# EAGLE design H23R30 (EAGLE 9.6.2)

## Sheet 1 of 2
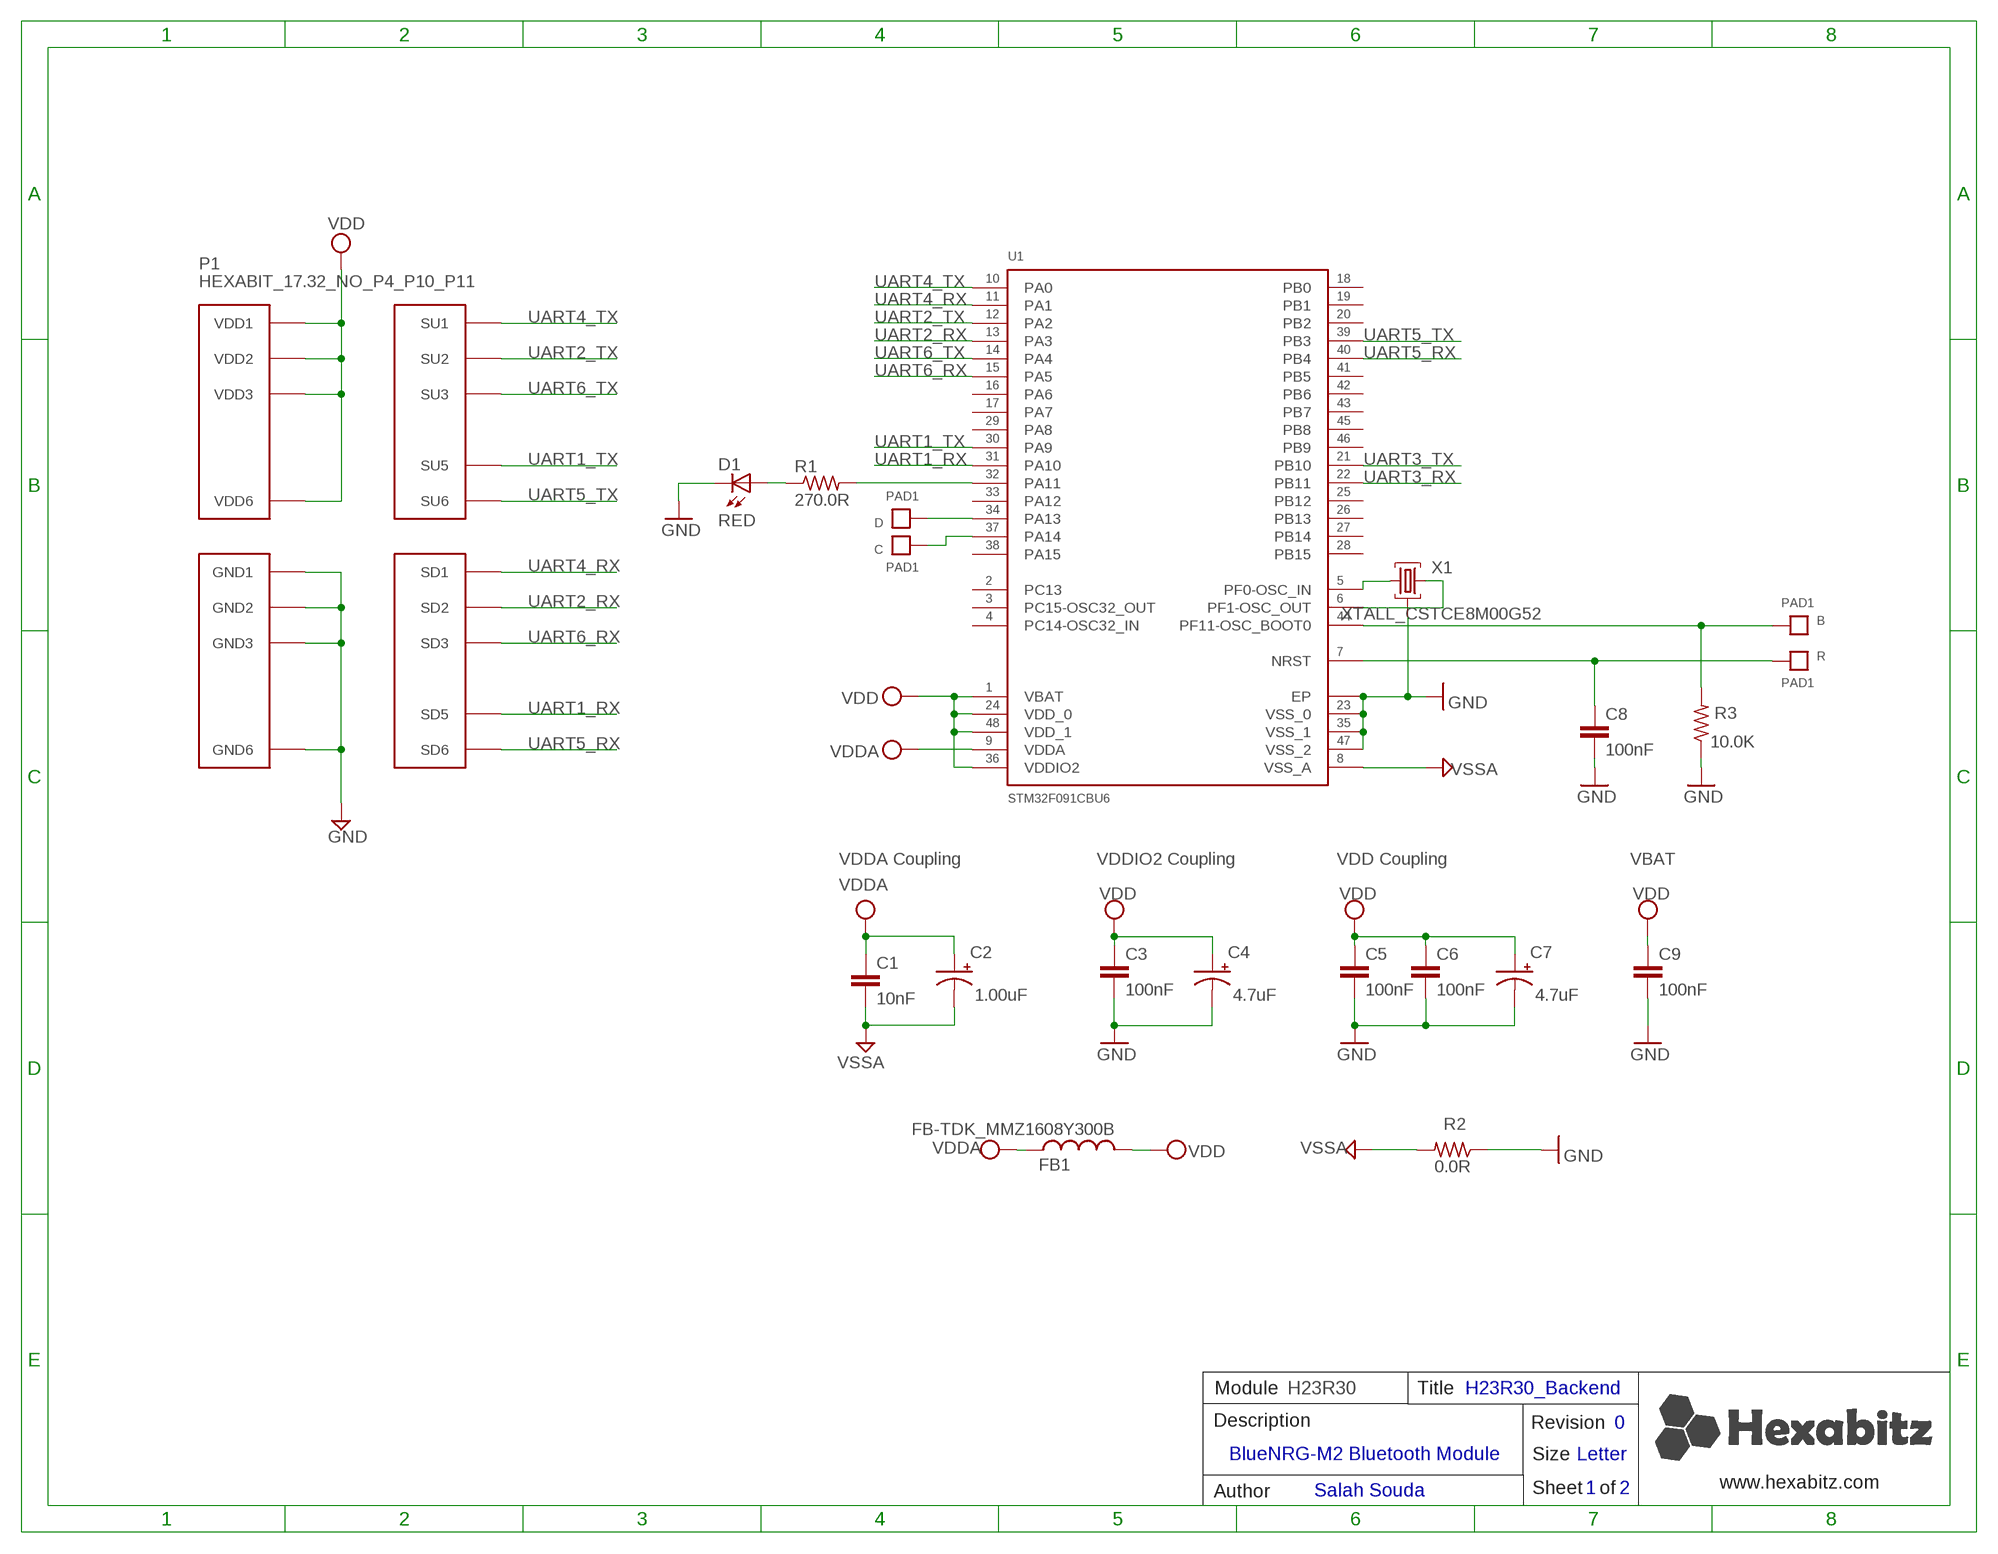
[diagram p0: schematic, sheet 1]

### Parts
B  PAD1  [PAD1]
C  PAD1  [PAD1]
C1  10nF  C-0603  [C-0603]
C2  1.00uF  C-0805-POL  [C-0805-POL]
C3  100nF  C-0603  [C-0603]
C4  4.7uF  C-0805-POL  [C-0805-POL]
C5  100nF  C-0603  [C-0603]
C6  100nF  C-0603  [C-0603]
C7  4.7uF  C-0805-POL  [C-0805-POL]
C8  100nF  C-0603  [C-0603]
C9  100nF  C-0603  [C-0603]
D  PAD1  [PAD1]
D1  RED  VLMS1300-GS08  [VLMS1300-GS08]
FB1  FB-TDK_MMZ1608Y300B  [FB-TDK_MMZ1608Y300B]
P1  HEXABIT_17.32_NO_P4_P10_P11  [HEXABIT_17.32_NO_P4_P10_P11]
R  PAD1  [PAD1]
R1  270.0R  R-0603  [R-0603]
R2  0.0R  R-0603  [R-0603]
R3  10.0K  R-0603  [R-0603]
U1  STM32F091CBU6  [STM32F091CBU6]
X1  XTALL_CSTCE8M00G52  [XTALL_CSTCE8M00G52]

### Nets
B1: B.P$1 B.P$2 R3.2 U1.P$44(PF11-OSC_BOOT0)
GND: C3.2 C4.2(-) C5.2 C6.2 C7.2(-) C8.2 C9.2 D1.C P1.PAD_PD7(GND1) P1.PAD_PD8(GND2) P1.PAD_PD9(GND3) P1.PAD_PD12(GND6) R2.1 R3.1 U1.EP U1.P$23(VSS_0) U1.P$35(VSS_1) U1.P$47(VSS_2) X1.P$2 ; also sheet 2
N$3: R1.2 U1.P$32(PA11)
N$4: D1.A R1.1
N$5: U1.P$5(PF0-OSC_IN) X1.P$1
N$6: U1.P$6(PF1-OSC_OUT) X1.P$3
N$7: D.P$1 D.P$2 U1.P$34(PA13)
N$9: C.P$1 C.P$2 U1.P$37(PA14)
R1: C8.1 R.P$1 R.P$2 U1.P$7(NRST)
UART1_RX: P1.PAD_PD5(SD5) U1.P$31(PA10)
UART1_TX: P1.PAD_PU5(SU5) U1.P$30(PA9)
UART2_RX: P1.PAD_PD2(SD2) U1.P$13(PA3)
UART2_TX: P1.PAD_PU2(SU2) U1.P$12(PA2)
UART3_RX: U1.P$22(PB11) ; also sheet 2
UART3_TX: U1.P$21(PB10) ; also sheet 2
UART4_RX: P1.PAD_PD1(SD1) U1.P$11(PA1)
UART4_TX: P1.PAD_PU1(SU1) U1.P$10(PA0)
UART5_RX: P1.PAD_PD6(SD6) U1.P$40(PB4)
UART5_TX: P1.PAD_PU6(SU6) U1.P$39(PB3)
UART6_RX: P1.PAD_PD3(SD3) U1.P$15(PA5)
UART6_TX: P1.PAD_PU3(SU3) U1.P$14(PA4)
VDD: C3.1 C4.1(+) C5.1 C6.1 C7.1(+) C9.1 FB1.2 P1.PAD_PU7(VDD1) P1.PAD_PU8(VDD2) P1.PAD_PU9(VDD3) P1.PAD_PU12(VDD6) U1.P$1(VBAT) U1.P$24(VDD_0) U1.P$36(VDDIO2) U1.P$48(VDD_1) ; also sheet 2
VDDA: C1.1 C2.1(+) FB1.1 U1.P$9(VDDA)
VSSA: C1.2 C2.2(-) R2.2 U1.P$8(VSS_A)
Unconnected: U1.P$2(PC13) U1.P$3(PC14-OSC32_IN) U1.P$4(PC15-OSC32_OUT) U1.P$16(PA6) U1.P$17(PA7) U1.P$18(PB0) U1.P$19(PB1) U1.P$20(PB2) U1.P$25(PB12) U1.P$26(PB13) U1.P$27(PB14) U1.P$28(PB15) U1.P$29(PA8) U1.P$33(PA12) U1.P$38(PA15) U1.P$41(PB5) U1.P$42(PB6) U1.P$43(PB7) U1.P$45(PB8) U1.P$46(PB9)

### Notes on the sheet
- VDDA Coupling | VDDIO2 Coupling | VDD Coupling | VBAT
- Module | H23R30 | Title | H23R30_Backend
- Description | Revision | 0
- BlueNRG-M2 Bluetooth Module
- Size | Letter
- www.hexabitz.com
- Author | Salah Souda | Sheet   of | 1 | 2
- C:/Users/Admin/Desktop/logodraft.bmp

## Sheet 2 of 2
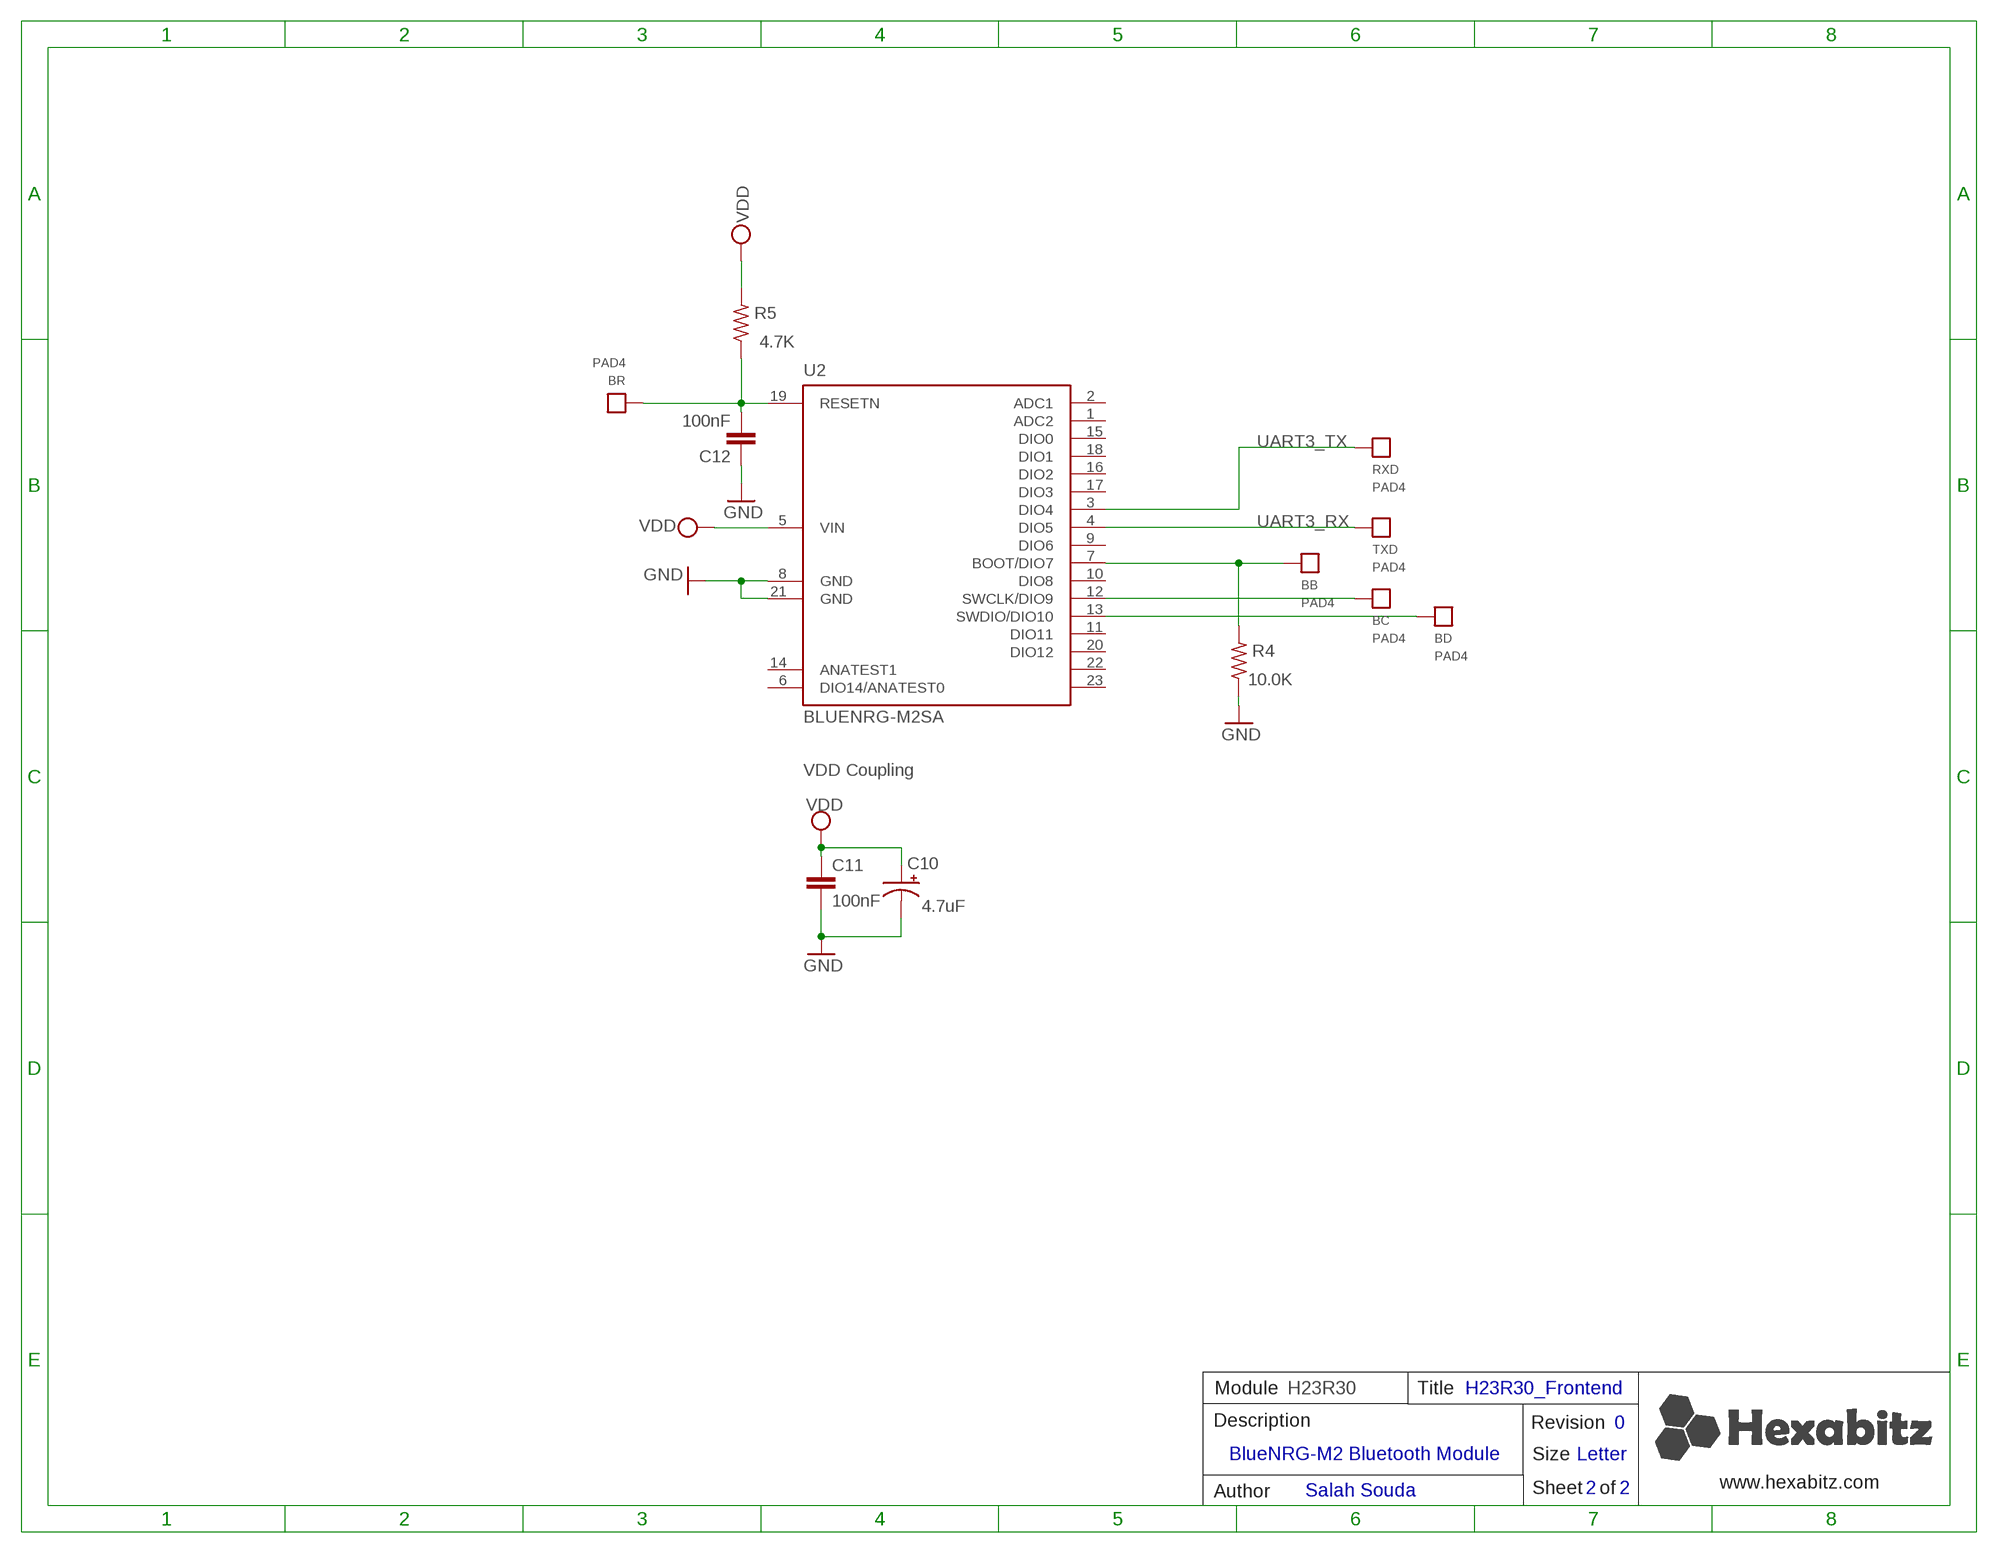
[diagram p1: schematic, sheet 2]

### Parts
BB  PAD4  [PAD4]
BC  PAD4  [PAD4]
BD  PAD4  [PAD4]
BR  PAD4  [PAD4]
C10  4.7uF  C-0805-POL  [C-0805-POL]
C11  100nF  C-0603  [C-0603]
C12  100nF  C-0603  [C-0603]
R4  10.0K  R-0603  [R-0603]
R5  4.7K  R-0603  [R-0603]
RXD  PAD4  [PAD4]
TXD  PAD4  [PAD4]
U2  BLUENRG-M2SA  [BLURNGR-M2SA_FOOTPRINT]

### Nets
B2: BB.P$1 R4.2 U2.7(BOOT/DIO7)
GND: C10.2(-) C11.2 C12.1 R4.1 U2.8(GND) U2.21(GND) ; also sheet 1
N$1: BD.P$1 U2.13(SWDIO/DIO10)
N$2: BC.P$1 U2.12(SWCLK/DIO9)
N$8: BR.P$1 C12.2 R5.1 U2.19(RESETN)
UART3_RX: TXD.P$1 U2.4(DIO5) ; also sheet 1
UART3_TX: RXD.P$1 U2.3(DIO4) ; also sheet 1
VDD: C10.1(+) C11.1 R5.2 U2.5(VIN) ; also sheet 1
Unconnected: U2.1(ADC2) U2.2(ADC1) U2.6(DIO14/ANATEST0) U2.9(DIO6) U2.10(DIO8) U2.11(DIO11) U2.14(ANATEST1) U2.15(DIO0) U2.16(DIO2) U2.17(DIO3) U2.18(DIO1) U2.20(DIO12) U2.22 U2.23

### Notes on the sheet
- VDD Coupling
- Module | H23R30 | Title | H23R30_Frontend
- Description | Revision | 0
- BlueNRG-M2 Bluetooth Module
- Size | Letter
- www.hexabitz.com
- Author | Salah Souda | Sheet   of | 2 | 2

## Library data of the parts
B C D R = HEXABITZ_CONNECTION_PARTS:PAD1
BB BC BD BR RXD TXD = HEXABITZ_CONNECTION_PARTS:PAD4
C1 = HEXABITZ_RCLS:C-0603: CAP CER 10% X7R 0603; CAPACITANCE: 10nF; MFN: KEMET; MPN: C0603C103K5RACTU; OCTOPART_URL: https://octopart.com/c0603c103k5ractu-kemet-133094?r=sp&s=R_iPBxLnSmGqhkU2rIMFpg; TOLERANCE: 10%; VOLTAGE_RATING: 50V
C2 = HEXABITZ_RCLS:C-0805-POL: Cap Tant Solid SMD 2012; CAPACITANCE: 1.00uF; MFN: Yageo; MPN: CC0805KKX7R7BB105; OCTOPART_URL: https://octopart.com/cc0805kkx7r7bb105-yageo-8376555?r=sp&s=YKl1wwtkROau_X5nniH2ig; TOLERANCE: 10%; VOLTAGE_RATING: 16V
C3 C6 C8 = HEXABITZ_RCLS:C-0603: CAP CER 10% X7R 0603; CAPACITANCE: 100nF; MFN: KEMET; MPN: C0603C104K8RACTU; OCTOPART_URL: https://octopart.com/c0603c104k8ractu-kemet-145075?r=sp&s=9bS9ASSwSEqMCE9KBEQZ0g; TOLERANCE: 10%; VOLTAGE_RATING: 10V
C4 C7 C10 = HEXABITZ_RCLS:C-0805-POL: Cap Tant Solid SMD 2012; CAPACITANCE: 4.7uF; MFN: Murata; MPN: GRM21BC81E475KA12L; OCTOPART_URL: https://octopart.com/grm21bc81e475ka12l-murata-10331911?r=sp&s=RY3qZSD8T6mG6TC9CHI5qQ; TOLERANCE: 10%; VOLTAGE_RATING: 25V
C5 C11 C12 = HEXABITZ_RCLS:C-0603: CAP CER 10% X7R 0603; CAPACITANCE: 100nF; MFN: KEMET; MPN: C0603C104K8RACTU; OCTOPART_URL: https://octopart.com/c0603c104k8ractu-kemet-145075?r=sp&s=9bS9ASSwSEqMCE9KBEQZ0g; TOLERANCE: 10%; VOLTAGE_RATING: 10
C9 = HEXABITZ_RCLS:C-0603: CAP CER 10% X7R 0603; CAPACITANCE: 100nF; MFN: KEMET; MPN: C0603C104K8RACTU; OCTOPART_URL: https://octopart.com/c0603c104k8ractu-kemet-145075?r=sp&s=9bS9ASSwSEqMCE9KBEQZ0g; TOLERANCE: 10V; VOLTAGE_RATING: 10%
D1 = HEXABITZ_USER_INTERFACE_PARTS:VLMS1300-GS08: Red 0603 130° Clear 54 mcd 2 V Surface Mount ChipLED ; Octopart Url : http://octopart.com/vlms1300-gs08-vishay-21709201; MFN: Vishay; MPN: VLMS1300-GS08; OCTOPART_URL: https://octopart.com/vlms1300-gs08-vishay-21709201?r=sp&s=_gcP4_q8T1SC6PJQPTQ9yA
FB1 = HEXABITZ_RCLS:FB-TDK_MMZ1608Y300B: Ferrite Beads Multi-Layer 30Ohm 25% 100MHz 1.5A 50mOhm DCR 0603; MFN: TDK; MPN: MMZ1608Y300B; OCTOPART_URL: https://octopart.com/mmz1608y300b-tdk-368280?r=sp&s=cd9_2ZEqQ9q9UNBuQgHAiA
P1 = hexabitz_connectors:HEXABIT_?_NO_P4_P10_P11: Hexabitz Hexagon Module Connector Hexagon side length = 17.32mm. The following ports are removed: P4 P10 P11
R1 = HEXABITZ_RCLS:R-0603: Thick Film Resistors - SMD 0603; MFN: Yageo; MPN: RC0603FR-07270RL; OCTOPART_URL: https://octopart.com/search?q=RC0603FR-07270RL&start=0; RESISTANCE: 270.0 Ohm; TOLERANCE: 1%
R2 = HEXABITZ_RCLS:R-0603: Thick Film Resistors - SMD 0603; MFN: Yageo; MPN: RC0603JR-070RL; OCTOPART_URL: https://octopart.com/rc0603jr-070rl-yageo-1241539?r=sp&s=X2NteqRjRNWrnx42Y0aliA; RESISTANCE: 0.0 Ohm
R3 R4 = HEXABITZ_RCLS:R-0603: Thick Film Resistors - SMD 0603; MFN: Yageo; MPN: RC0603JR-0710KL; OCTOPART_URL: https://octopart.com/search?q=RC0603JR-0710KL&start=0; RESISTANCE: 10.0K Ohm; TOLERANCE: 5%
R5 = HEXABITZ_RCLS:R-0603: Thick Film Resistors - SMD 0603; MFN: Yageo; MPN: RC0603JR-074K7L; OCTOPART_URL: https://octopart.com/rc0603jr-074k7l-yageo-55458509?r=sp; RESISTANCE: 4.7K Ohm; TOLERANCE: 5%
U1 = HEXABITZ_ICs:STM32F091CBU6: Description : ARM-based 32-bit MCU, CAN, 12 timers, ADC, DAC & Comm. Interface, 2 to 3.6 V, -40 to 85 degC, 48-Pin UFQFPN, RoHS, Tray ;Parameter : Ciiva URL : https://ciiva.com/part/STM32F091CBU6-20240708, CiivaID : 20240708, Clock Speed : 48000000.0 Hz, Lifecycle Status : Active, Mounting Style : Surface Mount, Number of Pins : 48, Octopart Url : https://octopart.com/stm32f091cbu6-stmicroelectronics-51988677, OctopartID : 5f4f955c32ec8088, RAM Memory Size : 32768 B, REACH SVHC Compliance : No SVHC, RoHS : Compliant,; MFN: STMicroelectronics; MPN: STM32F091CBU6; OCTOPART_URL: https://octopart.com/stm32f091cbu6-stmicroelectronics-51988677?r=sp&s=bU6fpgsrTZOxHyt7jkfh3w
U2 = HEXABITZ_ICs:BLUENRG-M2SA: Embedded ST BlueNRG-2 BLE SoC ultra-low power Cortex-M0 32-bit based core – Bluetooth v5.0 compliant – Programmable embedded 256 kB Flash – 24 kB embedded RAM with data retention – Operating supply voltage: from 1.7 to 3.6 V – 1 x UART, 1 x I2C, 1xSPI, 14 x GPIO, 2 x multifunction timer, 10-bit ADC, watchdog and RTC, DMA controller, PDM stream processor, SWD debug interface Source: Datasheet <https://www.st.com/content/st_com/en/products/wireless-transceivers-mcus-and-modules/bluetooth-bluetooth-low-energy/bluenrg-m2.html>; MFN: STMicroelectronics; MPN: BlueNRG_M2SA; OCTOPART_URL: https://octopart.com/bluenrg-m2sa-stmicroelectronics-104772812?r=sp
X1 = HEXABITZ_OTHER_PARTS:XTALL_CSTCE8M00G52: MURATA CSTCE8M00G52-R0 RESONATOR, SMD, 8MHZ ; Octopart Url : https://octopart.com/cstce8m00g52-r0-murata-7145559; MFN: Murata; MPN: CSTCE8M00G52Z-R0; OCTOPART_URL: https://octopart.com/cstce8m00g52z-r0-murata-17755941?r=sp&s=JDnNJnrHQhyS8Zk4ofFWXw

## Board
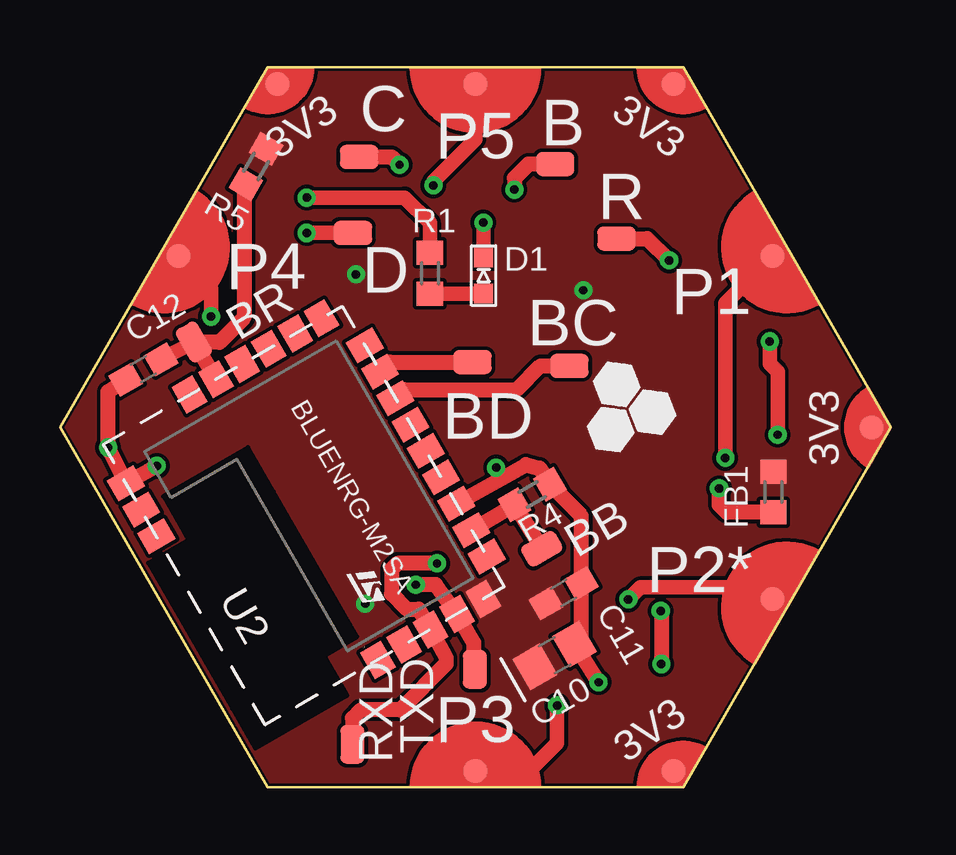
[diagram p2: board, top side]
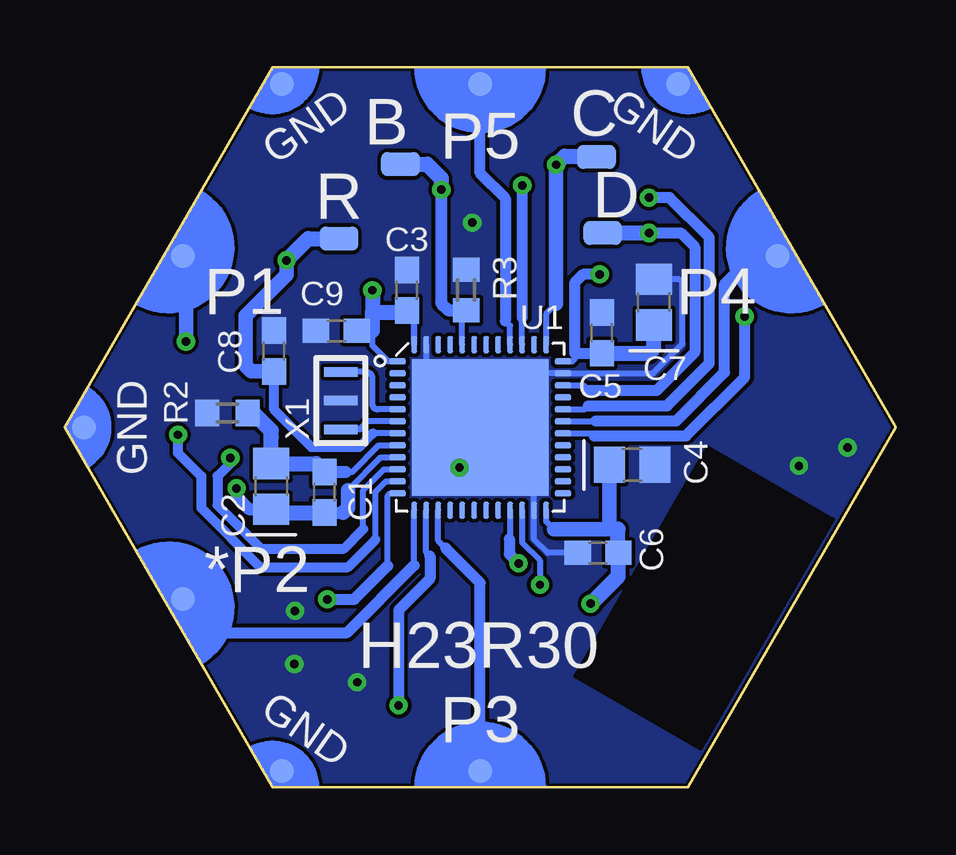
[diagram p3: board, bottom side, seen from below]

Size 34.64 x 30 mm. Coordinates in mm from the lower left corner, seen from the top.
Copper layers (1*16): Top 0.035mm / dielectric 1.5mm / Bottom 0.035mm
Design rules "2_layer": minimum track width 7mil, minimum drill 10mil, track to track 6mil, track to pad 6mil, pad to pad 6mil, via to via 6mil, smd to smd 0mil, copper to edge 1mil, drill to drill 8mil, minimum pad ring 10mil, minimum via ring 8mil, stop-mask expansion 2mil, vias tented up to drill 15mil, thermal gap 10mil

### Footprints (pad centres in the part's own frame; a part is rotated, then mirrored left to right if it is on the bottom)
PAD1 = smd 1.6 x 1: P$1 0,0 | smd 1.6 x 1 bottom: P$2 0,0
PAD4 = smd 1.6 x 1: P$1 0,0
C-0603 = smd 1.1 x 1: 1 -0.85,0; 2 0.85,0
C-0805-POL = smd 1.3 x 1.5: 1 -0.95,0; 2 0.95,0
VLMS1300-GS08 = smd 0.8 x 0.8: A 0,0.75; C 0,-0.75
FB-TDK_MMZ1608Y300B = smd 1 x 1.1: 1 -0.85,0; 2 0.85,0
HEXABIT_17.32_NO_P4_P10_P11 = smd 1 x 1 bottom: PAD_PD1 12.39,7.15; PAD_PD2 12.39,-7.15; PAD_PD3 0,-14.31; PAD_PD5 -12.39,7.15; PAD_PD6 0,14.31; PAD_PD7 8.26,14.31; PAD_PD8 16.52,0; PAD_PD9 8.26,-14.31; PAD_PD12 -8.26,14.31 | smd 1 x 1: PAD_PU1 12.39,7.15; PAD_PU2 12.39,-7.15; PAD_PU3 0,-14.31; PAD_PU5 -12.39,7.15; PAD_PU6 0,14.31; PAD_PU7 8.26,14.31; PAD_PU8 16.52,0; PAD_PU9 8.26,-14.31; PAD_PU12 -8.26,14.31
R-0603 = smd 1 x 1.1: 1 -0.85,0; 2 0.85,0
STM32F091CBU6 = smd 5.7 x 5.7: EP 0,0 | smd 0.25 x 0.7: P$1 -2.75,-3.45; P$2 -2.25,-3.45; P$3 -1.75,-3.45; P$4 -1.25,-3.45; P$5 -0.75,-3.45; P$6 -0.25,-3.45; P$7 0.25,-3.45; P$8 0.75,-3.45; P$9 1.25,-3.45; P$10 1.75,-3.45; P$11 2.25,-3.45; P$12 2.75,-3.45; P$25 2.75,3.45; P$26 2.25,3.45; P$27 1.75,3.45; P$28 1.25,3.45; P$29 0.75,3.45; P$30 0.25,3.45; P$31 -0.25,3.45; P$32 -0.75,3.45; P$33 -1.25,3.45; P$34 -1.75,3.45; P$35 -2.25,3.45; P$36 -2.75,3.45 | smd 0.7 x 0.25: P$13 3.45,-2.75; P$14 3.45,-2.25; P$15 3.45,-1.75; P$16 3.45,-1.25; P$17 3.45,-0.75; P$18 3.45,-0.25; P$19 3.45,0.25; P$20 3.45,0.75; P$21 3.45,1.25; P$22 3.45,1.75; P$23 3.45,2.25; P$24 3.45,2.75; P$37 -3.45,2.75; P$38 -3.45,2.25; P$39 -3.45,1.75; P$40 -3.45,1.25; P$41 -3.45,0.75; P$42 -3.45,0.25; P$43 -3.45,-0.25; P$44 -3.45,-0.75; P$45 -3.45,-1.25; P$46 -3.45,-1.75; P$47 -3.45,-2.25; P$48 -3.45,-2.75
BLURNGR-M2SA_FOOTPRINT = smd 1.27 x 1: 1 -6.35,1; 2 -6.35,-0.27; 3 -6.35,-1.54; 4 -6.35,-2.81; 5 -6.35,-4.08; 15 7.15,-4.08; 16 7.15,-2.81; 17 7.15,-1.54; 18 7.15,-0.27; 19 7.15,1; 20 7.15,2.27 | smd 1 x 1.27: 6 -4.89,-5.08; 7 -3.62,-5.08; 8 -2.35,-5.08; 9 -1.08,-5.08; 10 0.19,-5.08; 11 1.46,-5.08; 12 2.73,-5.08; 13 4,-5.08; 14 5.27,-5.08; 21 5.27,6.42; 22 4,6.42; 23 2.73,6.42
XTALL_CSTCE8M00G52 = smd 1.4 x 0.4: P$1 0,1.2; P$2 0,0; P$3 0,-1.2

### Placement (x,y rotation side)
B  20.65,25.97 0 top
BB  20.09,9.95 210 top
BC  21.23,17.57 0 top
BD  17.19,17.72 180 top
BR  5.59,18.56 120 top
C  12.47,26.28 0 top
C1  23.81,12.3 90 bottom
C2  26.03,12.55 90 bottom
C3  20.37,20.72 90 bottom
C4  10.98,13.44 0 bottom
C5  12.25,18.94 90 bottom
C6  12.41,9.77 180 bottom
C7  10.09,20.22 90 bottom
C8  25.91,18.18 90 bottom
C9  23.32,19.03 180 bottom
C10  20.62,5.5 30 top
C11  21,8.09 30 top
C12  3.48,17.41 30 top
D  12.21,23.1 180 top
D1  17.66,21.33 180 top
FB1  29.74,12.31 90 top
P1  17.32,15 0 top
R  23.2,22.87 0 top
R1  15.42,21.42 90 top
R2  27.86,15.6 0 bottom
R3  17.91,20.73 270 bottom
R4  19.68,12.21 210 top
R5  8.18,25.87 60 top
RXD  12.19,1.79 90 top
TXD  17.29,4.92 90 top
U1  17.32,15 270 bottom
U2  10.94,11.32 120 top
X1  23.13,16.12 0 bottom

### Tracks (layer width: path | path; a pad name or v marks a point on that pad's centre or on a via)
B1  (via drill 0.35)
  Top 0.635: B.P$1 19.53,25.97 18.95,25.39 v18.95,24.91
  Bottom 0.254: U1.P$44 18.07,19.72 R3.2 | R3.2
  Bottom 0.508: v18.95,24.91 18.95,20.18 18.64,19.88 R3.2
  Bottom 0.635: B.P$1 19.53,25.97 18.95,25.39 v18.95,24.91
B2
  Top 0.635: U2.7 R4.2 BB.P$1
GND  (via drill 0.35)
  Top 0.61: D1.C v17.66,23.53
  Top 0.635: v17.66,23.53 v17.65,23.53 | C12.1 2,16.5 v2,14.16 U2.21 v4.04,13.4 | v22.45,4.38 C10.2 21.74,6.27 C11.2 21.74,11.31 R4.1 20,13.31 19.43,13.45 18.42,12.89 | U2.8 18.39,12.87 18.42,12.89 | v25.07,5.14 25.07,7.28 v25.04,7.35 | v18.18,13.32 18.42,12.89
  Bottom 0.254: C7.2 9.01,21.17 8.89,21.04 8.89,18.48 10.12,17.25 U1.P$35 17.32,17.25 U1.EP | U1.P$47 19.57,15 U1.EP | U1.EP 15.07,15 U1.P$23 15.07,10.34 14.5,9.77 C6.2
  pour Bottom (isolate 0.102, no thermals): 8.66,0 25.98,0 34.64,15 25.98,30 8.66,30 0,15
N$1
  Top 0.635: U2.13 13.74,17.72 BD.P$1
N$2
  Top 0.635: U2.12 14.33,16.57 19.05,16.57 20.04,17.57 BC.P$1
N$3  (via drill 0.35)
  Top 0.61: v10.28,24.58 14.37,24.58 15.42,23.53 R1.2
  Bottom 0.254: U1.P$32 12.98,15.75 12.83,15.9
  Bottom 0.457: 12.83,15.9 9.53,15.9 7.77,17.67 7.77,22.92 9.43,24.58 v10.28,24.58
N$4
  Top 0.61: D1.A R1.1
  Top 0.635: R1.1
N$5
  Bottom 0.254: U1.P$5 21.6,15.75 arc90 21.82,15.97 21.82,17.04 arc-90 22.09,17.32 X1.P$1
N$6
  Bottom 0.254: U1.P$6 22.01,15.25 22.35,14.92 X1.P$3
N$7  (via drill 0.35)
  Top 0.61: D.P$1 v10.28,23.1
  Bottom 0.254: U1.P$34 13.01,16.75 12.8,16.55
  Bottom 0.457: 12.8,16.55 9.96,16.55 8.38,18.12 8.38,22.52 8.96,23.1 v10.28,23.1
  Bottom 0.635: D.P$1 v10.28,23.1
N$8
  Top 0.635: U2.19 BR.P$1 | BR.P$1 C12.2 | BR.P$1 5.59,18.55 6.65,18.55 7.67,19.57 7.67,25.06 R5.1
N$9  (via drill 0.35)
  Top 0.635: C.P$1 13.82,26.28 v14.16,25.94
  Bottom 0.254: 14.16,20.14 14.57,19.73 U1.P$37
  Bottom 0.61: 13.8,26.3 v14.16,25.94 14.16,20.14
  Bottom 0.635: 13.8,26.3 12.49,26.3 C.P$1
R1  (via drill 0.35)
  Top 0.635: R.P$1 24.49,22.87 v25.4,21.96
  Bottom 0.254: U1.P$7 21.8,14.75
  Bottom 0.406: 21.8,14.75 22.37,14.18 24.35,14.18 25.91,15.74 C8.1
  Bottom 0.61: v25.4,21.96 25.4,21.35 27.1,19.65 27.1,17.57 26.87,17.33 C8.1
  Bottom 0.635: v25.4,21.96 24.49,22.87 R.P$1
UART1_RX
  Bottom 0.254: U1.P$31 12.52,15.25 12.5,15.28
  Bottom 0.457: 12.5,15.28 9.14,15.28 7.13,17.29 7.13,20.97 5.95,22.15
  Bottom 0.61: 5.95,22.15 P1.PAD_PD5
UART1_TX  (via drill 0.35)
  Top 0.61: v6.3,19.62 6.3,20.78 P1.PAD_PU5
  Bottom 0.254: U1.P$30 12.68,14.75 12.57,14.65
  Bottom 0.457: 12.57,14.65 8.74,14.65 6.3,17.09 v6.3,19.62
UART2_RX
  Bottom 0.254: P1.PAD_PD2 28.31,6.45 | 20.07,9.25 U1.P$13
  Bottom 0.457: 28.31,6.45 22.87,6.45 20.07,9.25
UART2_TX  (via drill 0.35)
  Top 0.254: P1.PAD_PU2 29.23,8.33
  Top 0.61: 29.23,8.33 24.19,8.33 v23.7,7.84
  Bottom 0.254: 21.18,9.23 21.18,12.15 21.09,12.25 U1.P$12
  Bottom 0.457: v23.7,7.84 22.58,7.84 21.18,9.23
UART3_RX  (via drill 0.35)
  Top 0.635: TXD.P$1 17.24,4.97 17.24,6.03 U2.4 15.66,8.45 v14.83,8.45
  Bottom 0.254: U1.P$22 15.57,10.2 14.83,9.46 v14.83,8.45
UART3_TX  (via drill 0.35)
  Top 0.635: RXD.P$1 12.19,2.88 12.54,3.24 14.19,3.24 16.1,5.14 16.1,5.4 U2.3 14.96,7.43 14.45,7.43 13.81,8.07 13.81,9.08 14.07,9.34 v15.72,9.34
  Bottom 0.254: U1.P$21 16.07,10.38 16.1,10.35
  Bottom 0.457: 16.1,10.35 16.1,9.72 v15.72,9.34
UART4_RX  (via drill 0.35)
  Top 0.61: v29.92,14.69 29.92,17.31 29.59,17.64 v29.59,18.58
  Bottom 0.254: U1.P$11 21.26,12.75 21.69,12.32 21.69,10.33
  Bottom 0.406: 21.69,10.33 22.83,9.18 26.49,9.18 28.95,11.65 28.95,12.97 29.92,13.93 v29.92,14.69
  Bottom 0.61: v29.59,18.58 29.59,22.15 P1.PAD_PD1
UART4_TX  (via drill 0.35)
  Top 0.61: P1.PAD_PU1 27.73,20.17 v27.73,13.73
  Bottom 0.254: U1.P$10 21.33,13.25 22.2,12.38 22.2,10.76
  Bottom 0.406: v27.73,13.73 27.73,13.5 28.27,12.97 28.27,11.76 26.46,9.95 23,9.95 22.2,10.76
UART5_RX
  Bottom 0.254: U1.P$40 16.07,19.24 16.27,19.44
  Bottom 0.457: 16.27,19.44 16.27,24.54 17.32,25.59 P1.PAD_PD6
UART5_TX  (via drill 0.35)
  Top 0.61: v15.57,25.08 15.57,25.26 17.32,27.01 P1.PAD_PU6
  Bottom 0.254: U1.P$39 15.57,19.54 15.57,19.59
  Bottom 0.457: 15.57,19.59 v15.57,25.08
UART6_RX
  Bottom 0.254: U1.P$15 19.07,10.28 18.76,9.97
  Bottom 0.457: P1.PAD_PD3 17.32,8.52 18.76,9.97
UART6_TX  (via drill 0.35)
  Top 0.61: v20.72,3.42 20.72,1.83 19.58,0.69 P1.PAD_PU3
  Bottom 0.254: U1.P$14 19.57,9.8 19.42,9.64
  Bottom 0.457: v20.72,3.42 20.72,7.38 19.42,8.69 19.42,9.64
VDD  (via drill 0.35)
  Bottom 0.254: C3.1 20.07,19.87 U1.P$48 20.07,19.79 | U1.P$1 21.16,17.75 21.82,18.4 21.82,19.03 | U1.P$24 14.57,11.08 14.25,10.76 | U1.P$36 13.48,17.75 13.38,17.84 13.38,18.09
  Bottom 0.457: v12.34,21.38 13.03,21.38 13.38,21.02 13.38,18.09 C5.1
  Bottom 0.61: 14.25,10.76 11.93,10.76 | C4.1 11.93,10.76 | 11.93,10.76 11.57,10.76
  Bottom 0.635: 21.82,19.79 21.82,19.03 C9.1 | 11.57,10.76 C6.1 11.56,8.79 12.7,7.66 v12.72,7.66 | 12.24,13.45 C4.1 | C5.1 10.29,18.09 10.08,18.3 C7.1 | v21.82,20.71 21.82,19.79 | 21.82,19.79 20.37,19.79 C3.1
  pour Top (isolate 0.102, no thermals): 8.66,0 25.98,0 34.64,15 25.98,30 8.66,30 0,15
VDDA  (via drill 0.35)
  Top 0.635: FB1.1 27.8,11.46 27.48,11.77 v27.48,12.46
  Bottom 0.254: C1.1 23.59,11.45 | 22.83,12.38 21.47,13.75 U1.P$9
  Bottom 0.508: 23.59,11.45 23.03,11.45 | v27.48,12.46 27.48,12.1 26.97,11.59 C2.1
  Bottom 0.61: 23.03,11.45 22.83,11.65 22.83,12.38
  Bottom 0.635: C2.1 25.89,11.45 23.59,11.45
VSSA
  Bottom 0.254: 22.92,13.15 22.65,13.15 21.55,14.25 U1.P$8
  Bottom 0.508: C1.2 22.92,13.15
  Bottom 0.635: C1.2 24.15,13.49 C2.2 26.03,14.59 26.03,14.87 26.77,15.6 R2.2

### Text on the board
tPlace: 3V3 | P5 | 3V3 | P4 | P1 | 3V3 | P2* | P3 | 3V3
bPlace: GND | P5 | GND | P4 | P1 | GND | *P2 | H23R30 | P3 | GND
bNames: C | B | D | R